# EAGLE design cpOD (EAGLE 7.7.0)
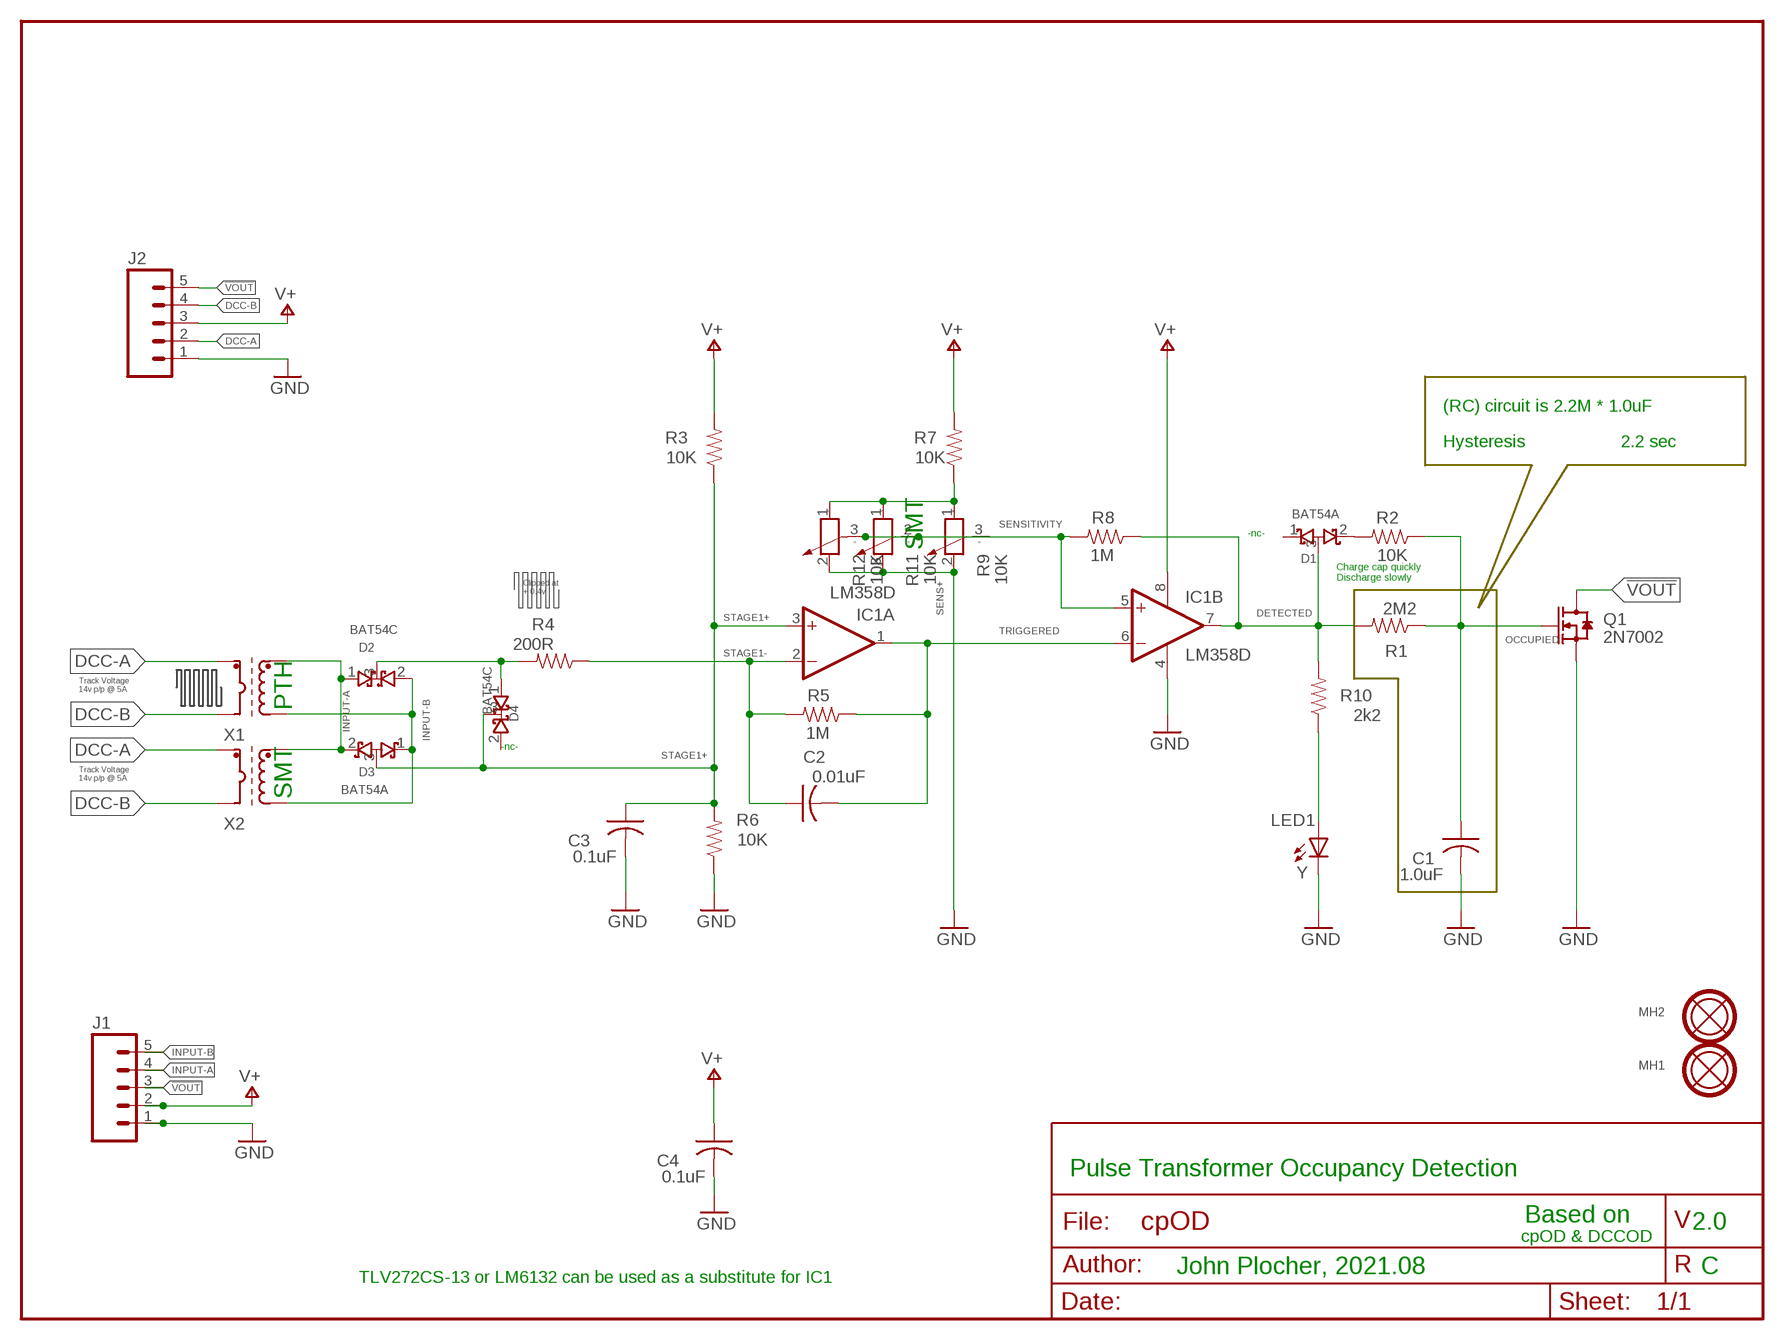
[diagram p0: schematic, sheet 1]

## Parts
C1  1.0uF  CAP0603  [0603-CAP]
C2  0.01uF  CAP0603  [0603-CAP]
C3  0.1uF  CAP0603  [0603-CAP]
C4  0.1uF  CAP0603  [0603-CAP]
D1  BAT54A  DIODE-BAT54A23  [SOT23]
D2  BAT54C  DIODE-BAT54C23  [SOT23]
D3  BAT54A  DIODE-BAT54A23  [SOT23]
D4  BAT54C  DIODE-BAT54C23  [SOT23]
IC1  LM358D  LM6132A  [SO-8]
J1  CONNECTOR-M05PTH  [1X05]
J2  CONNECTOR-M051.56  [KK-156-5]
LED1  Y  LED0603-LED  [0603-LED]
MH1  MOUNTINGHOLEL  [MOUNTINGHOLE-L]
MH2  MOUNTINGHOLEL  [MOUNTINGHOLE-L]
Q1  2N7002  MOSFET-N-2N7002-SOT23  [SOT23]
R1  2M2  R0603-RES  [0603-RES]
R2  10K  R0603-RES  [0603-RES]
R3  10K  R0603-RES  [0603-RES]
R4  200R  R0603-RES  [0603-RES]
R5  1M  R0603-RES  [0603-RES]
R6  10K  R0603-RES  [0603-RES]
R7  10K  R0603-RES  [0603-RES]
R8  1M  R0603-RES  [0603-RES]
R9  10K  R-POTENTIOMETERETB  [ST-4]
R10  2k2  R0603-RES  [0603-RES]
R11  10K  R-POTENTIOMETERPT-10S  [PT-10S]
R12  10K  R-POTENTIOMETERTC33X  [TC33X]
X1  PULSE-TRANSFORMERPTH-RB  [TH-T4B]
X2  PULSE-TRANSFORMERM  [M5300]

## Nets
!VOUT: J1.3 J2.5 Q1.3(D)
DCC-A: J2.2 X1.P2(DCC-B) X2.8(DCC-B)
DCC-B: J2.4 X1.P1(DCC-A) X2.7(DCC-A)
DETECTED: D1.3(COM) IC1.7(B:OUT) R1.2 R8.1 R10.2
FAST-RISE: D1.2(C2) R2.2
GND: C1.2 C3.2 C4.2 IC1.4(P:V-) J1.1 J2.1 LED1.C Q1.2(S) R6.1 R9.2(E) R11.3(E) R12.2(E)
INPUT-A: D2.1(A1) D3.2(C2) J1.4 X1.S2(OUT-B) X2.1(OUT-B)
INPUT-B: D2.2(A2) D3.1(C1) J1.5 X1.S1(OUT-A) X2.3(OUT-A)
INPUT-NEGATIVE: D2.3(COM) D4.1(A1) R4.2
N$11: LED1.A R10.1
OCCUPIED: C1.1 Q1.1(G) R1.1 R2.1
SENS+: R7.1 R9.1(A) R11.1(A) R12.1(A)
SENSITIVITY: IC1.5(B:+IN) R8.2 R9.3(S) R11.2(S) R12.3(S)
STAGE1+: C3.1 D3.3(COM) D4.3(COM) IC1.3(A:+IN) R3.1 R6.2
STAGE1-: C2.1 IC1.2(A:-IN) R4.1 R5.2
TRIGGERED: C2.2 IC1.1(A:OUT) IC1.6(B:-IN) R5.1
V+: C4.1 IC1.8(P:V+) J1.2 J2.3 R3.2 R7.2
Unconnected: D1.1(C1) D4.2(A2)

## Notes on the sheet
- (RC) circuit is 2.2M * 1.0uF
- Hysteresis | 2.2 sec
- -nc-
- SMT
- Charge cap quickly
  Discharge slowly
- Clipped at
  + 0.4v
- Track Voltage
  14v p/p @ 5A
- PTH
- -nc-
- Track Voltage
  14v p/p @ 5A
- SMT
- Pulse Transformer Occupancy Detection
- Based on
- 2.0
- cpOD & DCCOD
- John Plocher, 2021.08 | C
- TLV272CS-13 or LM6132 can be used as a substitute for IC1

## Library data of the parts
C1-C4 = SPCoast:CAP*
D1 D3 = SPCoast:DIODE-BAT54A
D2 D4 = SPCoast:DIODE-BAT54C
IC1 = SPCoast:LM6132A
J1 J2 = SPCoast:CONNECTOR-M05: Header 5 Standard 5-pin 0.1" header. Use with straight break away headers (SKU : PRT-00116), right angle break away headers (PRT-00553), swiss pins (PRT-00743), machine pins (PRT-00117), and female headers (PRT-00115). Molex polarized connector foot print use with SKU : PRT-08230 with associated crimp pins and housings.
LED1 = SPCoast:LED*
MH1 MH2 = SPCoast:MOUNTINGHOLE: Mounting hole with top and bottom copper and stop rings
Q1 = SPCoast:MOSFET-N-*-?: CJ2302：SMD MOSFET N-CH 20V-2.1A DMN4468 - SO8 30v/10A
R1-R8 R10 = SPCoast:R*: Resistor Basic schematic elements and footprints for 0603, 1206, and PTH 1/10th watt (small) resistors.
R9 R11 R12 = SPCoast:R-POTENTIOMETER: Potentiometer
X1 X2 = SPCoast:PULSE-TRANSFORMER: TRANSFORMER SMD wideband transformer

## Board
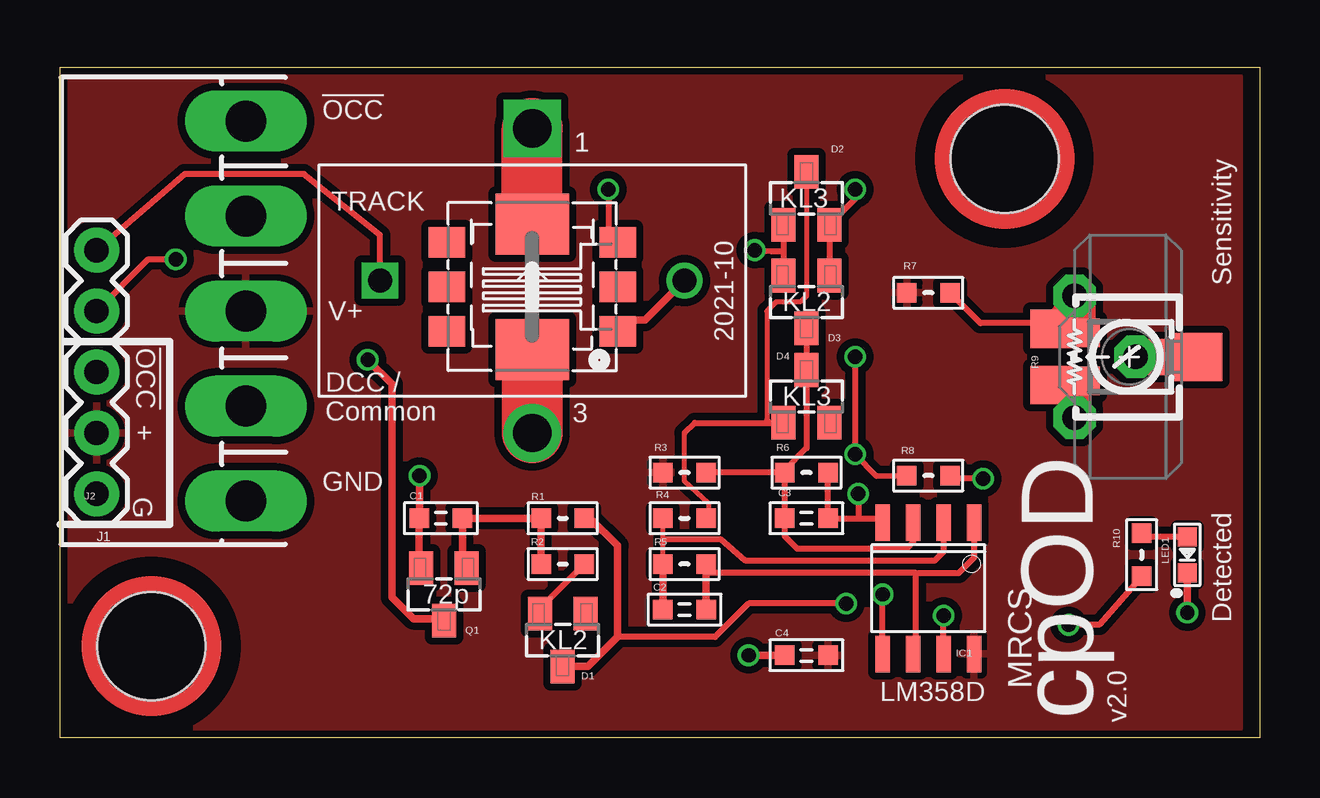
[diagram p1: board, top side]
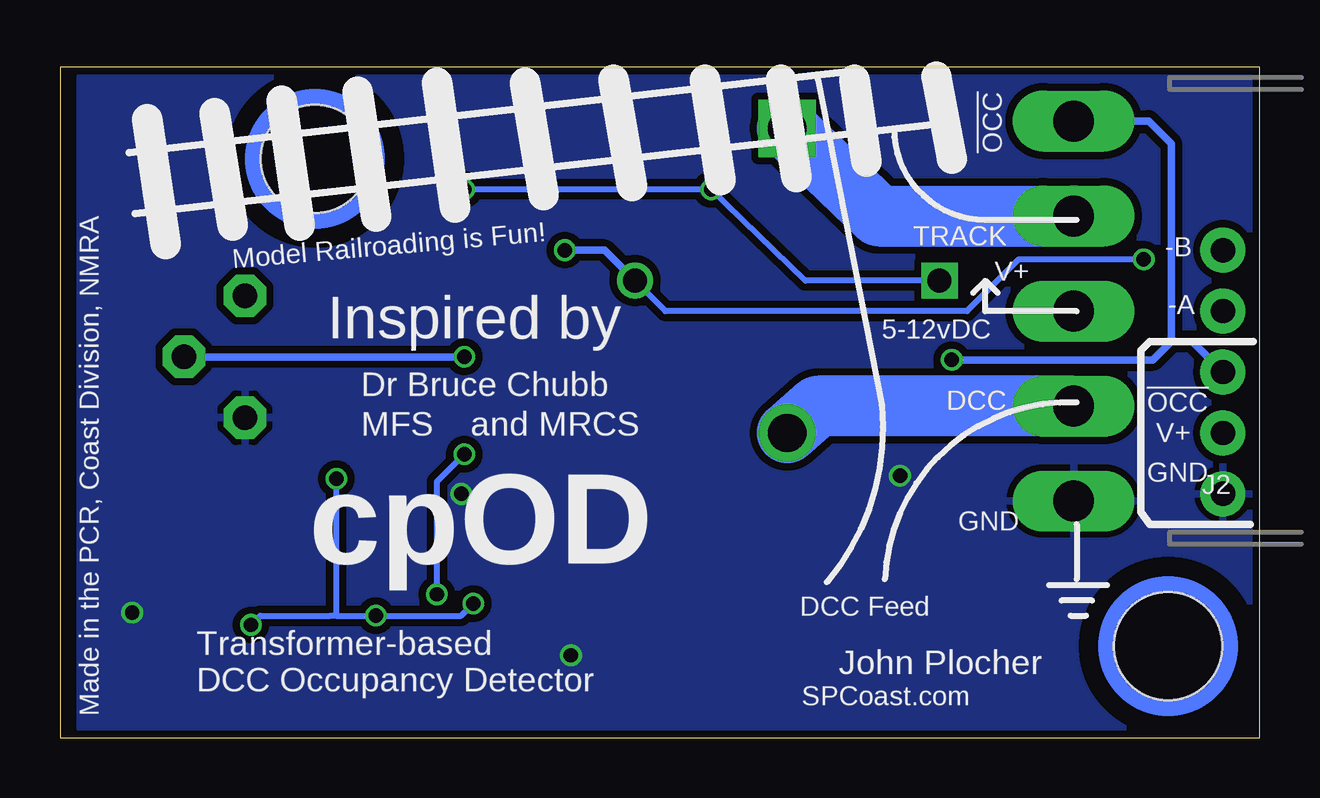
[diagram p2: board, bottom side, seen from below]

Size 50 x 27.94 mm. Coordinates in mm from the lower left corner, seen from the top.
Outline: 0,0 0,27.94 50,27.94 50,0 0,0
Copper layers (1*16): Top 0.035mm / dielectric 1.5mm / Bottom 0.035mm
Design rules "SeeedStudio_2layer_DRU_no_angle_20140221": minimum track width 6mil, minimum drill 12mil, track to track 6mil, track to pad 6mil, pad to pad 6mil, via to via 6mil, smd to smd 0mil, copper to edge 10mil, drill to drill 10mil, minimum pad ring 10mil, minimum via ring 6mil, stop-mask expansion 2mil, vias tented up to drill 100mil, thermal gap 10mil

### Footprints (pad centres in the part's own frame; a part is rotated, then mirrored left to right if it is on the bottom)
0603-CAP = smd 0.813 x 0.813: 1 -0.9,0; 2 0.9,0
SOT23 = smd 1.4 x 1: 1 1.1,-0.95; 2 1.1,0.95; 3 -1.1,0
SO-8 = smd 0.61 x 1.524: 1 -1.905,-2.743; 2 -0.635,-2.743; 3 0.635,-2.743; 4 1.905,-2.743; 5 1.905,2.743; 6 0.635,2.743; 7 -0.635,2.743; 8 -1.905,2.743
1X05 = drill 1.016 pad 1.88: 1 0,0; 2 2.54,0; 3 5.08,0; 4 7.62,0; 5 10.16,0
KK-156-5 = drill 1.7 pad 2.184 long: 1 -7.92,0; 2 -3.96,0; 3 0,0; 4 3.96,0; 5 7.92,0
0603-LED = smd 0.8 x 0.8: A 0.75,0; C -0.75,0
MOUNTINGHOLE-L = hole 4.5: 0,0
0603-RES = smd 0.813 x 0.813: 1 -0.9,0; 2 0.9,0
ST-4 = smd 2 x 1.6: 1 3,-1.175; 2 3,1.175 | smd 2 x 2: 3 -3,0
PT-10S = drill 1.016 pad 1.778 octagon: 1 -2.54,-1.27; 2 0,1.27; 3 2.54,-1.27
TC33X = smd 1.2 x 1.2: 1 1.825,-1; 2 1.825,1 | smd 1.6 x 1.5: 3 -1.5,0
TH-T4B = drill 1.6 square: P1 0,6.35 | drill 1.6: P2 0,-6.35 | drill 1 square: S1 -6.35,0 | drill 1: S2 6.35,0
M5300 = smd 1.52 x 1.27: 1 3.555,-1.85; 2 3.555,0; 3 3.555,1.85; 4 -3.555,1.85; 5 -3.555,0; 6 -3.555,-1.85 | smd 3.05 x 2.54: 7 0,2.615; 8 0,-2.615

### Placement (x,y rotation side)
C1  15.88,9.14 180 top
C2  26.04,5.33 0 top
C3  31.11,9.14 0 top
C4  31.11,3.43 180 top
D1  20.95,4.06 90 top
D2  31.11,22.48 270 top
D3  31.11,18.16 90 top
D4  31.11,14.22 270 top
IC1  36.2,6.22 180 top
J1  1.52,10.16 90 top
J2  7.75,17.78 90 top
LED1  46.99,7.62 90 top
MH1  3.81,3.81 0 top
MH2  39.37,24.13 0 top
Q1  16,5.97 90 top
R1  20.95,9.14 0 top
R2  20.95,7.24 0 top
R3  26.04,11.05 180 top
R4  26.04,9.14 0 top
R5  26.04,7.24 180 top
R6  31.11,11.05 180 top
R7  36.2,18.54 180 top
R8  36.2,10.92 180 top
R9  44.45,15.88 180 top
R10  45.09,7.62 270 top
R11  43.56,15.88 270 top
R12  44.58,15.88 180 top
X1  19.68,19.05 0 top
X2  19.68,18.8 0 top

### Tracks (layer width: path | path; a pad name or v marks a point on that pad's centre or on a via)
!VOUT  (via drill 0.6)
  Top 0.305: v12.83,15.75 13.84,14.73 13.84,5.84 14.73,4.95 15.92,4.95 Q1.3 15.96,4.83
  Bottom 0.305: J1.3 2.79,16.51 3.68,16.51 | J2.5 4.62,25.7 3.68,24.77 3.68,16.51 | v12.83,15.75 4.45,15.75 3.68,16.51
DCC-A
  Top 2.54: X2.8 X1.P2
  Bottom 2.54: J2.2 18.41,13.82 X1.P2
DCC-B
  Top 2.54: X2.7 X1.P1
  Bottom 2.54: X1.P1 15.88,21.74 J2.4
DETECTED  (via drill 0.6)
  Top 0.254: IC1.7 v36.83,5.08 | v32.77,5.59 28.7,5.59 27.3,4.19 23.24,4.19 | v38.48,10.79 37.09,10.81 R8.1 | R10.2 43.32,4.7 v42.04,4.7
  Top 0.305: 21,2.79 D1.3 22.01,2.96 23.24,4.19 23.24,8 22.1,9.14 R1.2
  Bottom 0.254: v32.77,5.59 33.27,5.08 v36.83,5.08 38.48,5.08 | v38.48,10.79 38.48,5.08 | v42.04,4.7 41.66,5.08 38.73,5.08 38.48,5.08
FAST-RISE
  Top 0.254: D1.2 20,5.39 R2.2
GND  (via drill 0.6)
  Top 0.254: 33.27,9.14 34.11,9.14 IC1.4 | v33.27,10.16 33.27,9.14 | R6.1 C3.2 33.27,9.14
  Top 0.305: 14.97,7.02 Q1.2 14.97,7.15 C1.2 14.99,9.15 v14.99,10.92 | 41.53,14.62 R9.2 42.16,14.7 42.58,14.7 R12.2 | LED1.C v46.99,5.21 | C4.2 v28.7,3.43
  Top 0.813: 42.16,14.7 42.16,14.35 R11.3 42.8,14.99
  pour Bottom (isolate 0.305): 0.38,27.56 49.15,27.56 49.15,0.38 0.38,0.38
INPUT-A  (via drill 0.6)
  Top 0.254: J1.4 3.68,19.94 v4.83,19.94 | X2.1 23.44,17.14 | D2.1 30.16,20.27 | 30.16,20.27 D3.2 | 30.16,20.27 29.65,20.27 v28.96,20.32
  Top 0.305: X1.S2 24.38,17.4 23.5,17.4 23.24,17.14 X2.1
  Bottom 0.254: v4.83,19.94 10.03,19.94 12.19,17.78 24.77,17.78 X1.S2
  Bottom 0.305: X1.S2 27.3,20.32 v28.96,20.32
INPUT-B  (via drill 0.6)
  Top 0.254: X1.S1 13.34,20.95 10.16,23.5 5.21,23.5 J1.5 | v22.86,22.86 22.86,21.08 23.3,20.7 X2.3 | D3.1 D2.2 32.64,21.95 33.15,22.48 v33.15,22.86
  Bottom 0.254: X1.S1 18.92,19.05 v22.86,22.86 v33.15,22.86
INPUT-NEGATIVE
  Top 0.203: 26.04,12.7 26.04,10.67 27.04,9.77 27.04,9.14 R4.2 | D2.3 31.11,18.41 30.86,18.16 29.84,18.16 29.46,17.78 29.46,13.25 29.59,13.12
  Top 0.254: 26.04,12.7 26.46,13.12 29.59,13.12 D4.1
N$11
  Top 0.254: LED1.A 45.23,8.37 R10.1
OCCUPIED
  Top 0.305: Q1.1 16.77,7.12 C1.1 R1.1 R2.1
SENS+
  Top 0.254: 41.4,17.27 38.37,17.27 R7.1
  Top 0.305: R12.1 42.58,17.05 R9.1
  Top 0.813: R12.1 42.75,17.99 R11.1 41.4,17.27
SENSITIVITY  (via drill 0.6)
  Top 0.254: IC1.5 v34.29,5.97 | R8.2 34.02,10.91 v33.15,11.81 v33.15,15.88
  Top 0.305: R12.3 R9.3
  Top 0.406: R12.3 R11.2
  Bottom 0.254: v34.29,5.97 34.29,10.67 v33.15,11.81
  Bottom 0.305: v33.15,15.88 R11.2
STAGE1+
  Top 0.254: R6.2 C3.1 30.21,8.39 30.73,7.87 35.31,7.87 35.56,8.13 IC1.3 | R6.2 30.21,11.16 31.11,12.06 D4.3 D3.3 | R6.2 R3.1
STAGE1-
  Top 0.203: R5.2 25.14,8.26 | 25.14,8.26 R4.1 | 25.15,8.26 25.14,8.26
  Top 0.254: IC1.2 36.83,7.75 36.45,7.37 28.57,7.37 27.56,8.26 25.15,8.26 | R5.2 25.4,7.5
  Top 0.305: C2.1 R5.2
TRIGGERED
  Top 0.254: IC1.1 38.1,7.49 37.47,6.86 35.69,6.86 | IC1.6 35.69,3.61 35.69,6.86 | 35.69,6.86 26.93,6.86
  Top 0.305: C2.2 26.93,6.86 R5.1
V+
  pour Top (isolate 0.305): 0.38,27.56 49.15,27.56 49.15,0.38 0.38,0.38

### Text on the board
tPlace: !OCC | 1 | Sensitivity | TRACK | KL3 | KL2 | V+ | 2021-10 | !OCC | KL3 | DCC / / Common | 3 | + | G | GND | Detected | 72p | KL2 | LM358D | MRCS | cpOD | v2.0
bPlace: !OCC | TRACK | -B | Model Railroading is Fun! | V+ | -A | 5-12vDC | Inspired by | !OCC | DCC | Dr Bruce Chubb | and MRCS | MFS | V+ | GND | J2 | GND | cpOD | DCC Feed | John Plocher | SPCoast.com | Transformer-based / DCC Occupancy Detector | Made in the PCR, Coast Division, NMRA
_tNames: D2 | R7 | D3 | D4 | R9 | R3 | R6 | R8 | J2 | C1 | R1 | R4 | C3 | J1 | R10 | R2 | R5 | LED1 | C2 | Q1 | C4 | IC1 | D1